# EAGLE design attiny_rc_switch (EAGLE 9.7.0)
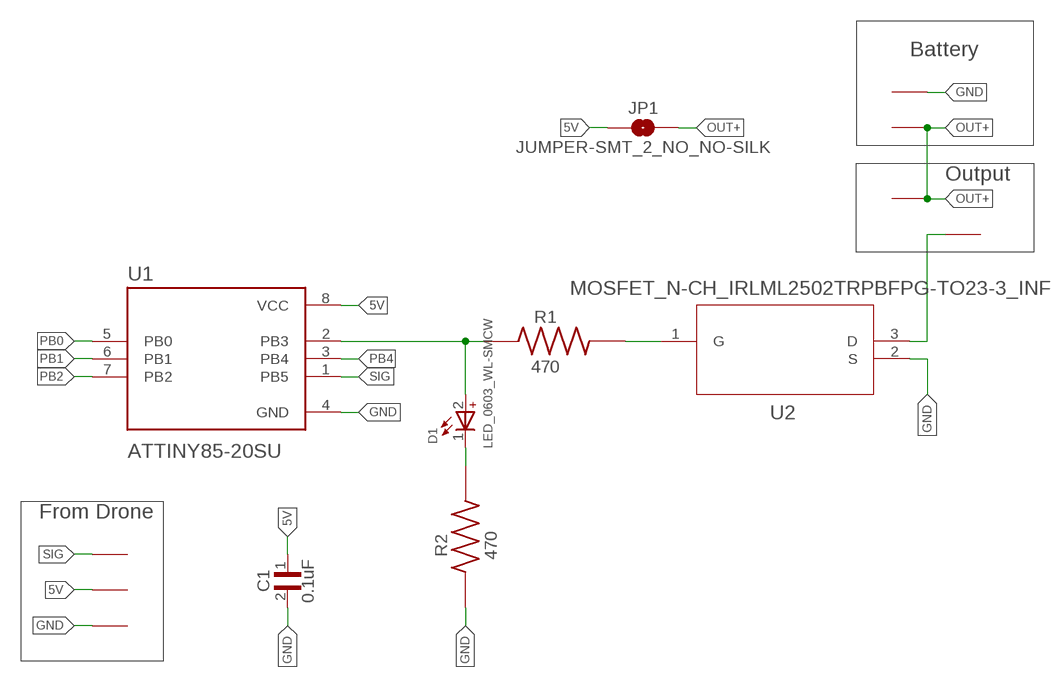
[diagram p0: schematic, sheet 1]

## Parts
C1  0.1uF  CAPACITOR_CERAMIC_0603_50V_CC0603ZRY5V9BB  [CC0603ZRY5V9BB]
D1  LED_0603_WL-SMCW  [LED_0603_WL-SMCW]
JP1  JUMPER-SMT_2_NO_NO-SILK  [SMT-JUMPER_2_NO_NO-SILK]
R1  470  RESISTOR_0603_1/4W_RCS0603  [RCS0603]
R2  470  RESISTOR_0603_1/4W_RCS0603  [RCS0603]
U1  ATTINY85-20SU  [ATTINY85-20SU]
U2  MOSFET_N-CH_IRLML2502TRPBFPG-TO23-3_INF  [MOSFET_N-CH_IRLML2502TRPBF]
U$1  SMD_PAD  [SMD_PAD]
U$2  SMD_PAD  [SMD_PAD]
U$3  SMD_PAD  [SMD_PAD]
U$4  SMD_PAD  [SMD_PAD]
U$5  SMD_PAD  [SMD_PAD]
U$6  SMD_PAD  [SMD_PAD]
U$8  SMD_PAD  [SMD_PAD]

## Nets
5V: C1.1 JP1.1 U1.8(VCC) U$1.P$1
GND: C1.2 R2.1 U1.4(GND) U2.2(S) U$2.P$1 U$4.P$1
N$1: D1.2(+) R1.1 U1.2(PB3)
N$2: R1.2 U2.1(G)
N$3: D1.1(-) R2.2
OUT+: JP1.2 U$3.P$1 U$5.P$1
OUT-: U2.3(D) U$6.P$1
PB0: U1.5(PB0)
PB1: U1.6(PB1)
PB2: U1.7(PB2)
PB4: U1.3(PB4)
SIG: U1.1(PB5) U$8.P$1

## Notes on the sheet
- Battery
- Output
- From Drone

## Library data of the parts
C1 = scotts-library:CAPACITOR_CERAMIC_0603_50V_CC0603ZRY5V9BB: Cap Ceramic 0.1uF 50V Y5V -20% to 80% Pad SMD 0603 85?C T/R
D1 = scotts-library:LED_0603_WL-SMCW: WL-SMCW SMT Mono-color Chip LED Waterclea Characteristics Low energy consumption High reliability Low current requirement Fast switching No UV/IR radiation Smallest SMD LED package for exceptional brightness Top view LED Wide viewing angle Better solder ability Heat dissipation Applications Backlight for mobile and portable device keypads Indoor and outdoor message boards Flat backlight for LCDs, switches and symbols Display for industrial control systems and traffic Miniaturized color effects Pedestrian mark Optical indicators Tabular backlight: LCD, telephone key-press, power-switch, display board Indoor displays Signals Identifiers Backlight for automobile DVD LED General lighting Toys <https://www.we-online.com/catalog/media/o14904v209%20Family_WL-SMCW.jpg> Details see: www.we-online.com/catalog/WL-SMCW <www.we-online.com/catalog/WL-SMCW/?utm_source=eagle_model&utm_medium=description_link&utm_campaign=eisos_eagle> Updated by Ella Wu, 2022-06-16 2022(C) Wurth Elektronik
JP1 = SparkFun-Jumpers:JUMPER-SMT_2_NO: Normally open jumper This jumper has two pads in close proximity to each other. Apply solder to close the connection. Round pads are easier to solder for beginners, but are a lot larger. SparkFun Product that uses the round pads: SparkFun EL Sequencer <https://www.sparkfun.com/products/12781>
R1 R2 = scotts-library:RESISTOR_0603_1/4W_RCS0603: 10K OHM 5% 200PPM
U1 = scotts-library:ATTINY85-20SU: AVR AVR® ATtiny, Functional Safety (FuSa) Microcontroller IC 8-Bit 20MHz 8KB (4K x 16) FLASH 8-SOIC; AVAILABILITY: Good; DESCRIPTION: IC MCU 8BIT 8KB FLASH 8SOIC; MAXIMUM_PACKAGE_HEIGHT: 2.16 mm; MF: Microchip Technology; MP: ATTINY85V-10SU; PACKAGE: None; PARTREV: 2586Q–AVR–08/2013; PRICE: None; PURCHASE-URL: https://pricing.snapeda.com/search/part/ATTINY85V-10SU/?ref=eda
U2 = scotts-library:MOSFET_N-CH_IRLML2502TRPBF; COPYRIGHT: Copyright (C) 2024 Ultra Librarian. All rights reserved.; MANUFACTURER_PART_NUMBER: IRLML2502TRPBF; MFR_NAME: Infineon
U$1-U$6 U$8 = scotts-library:SMD_PAD

## Board
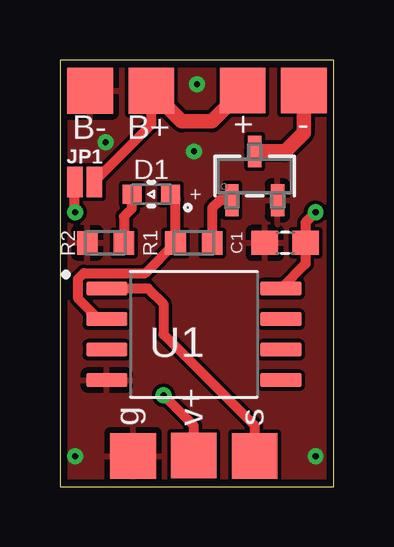
[diagram p1: board, top side]
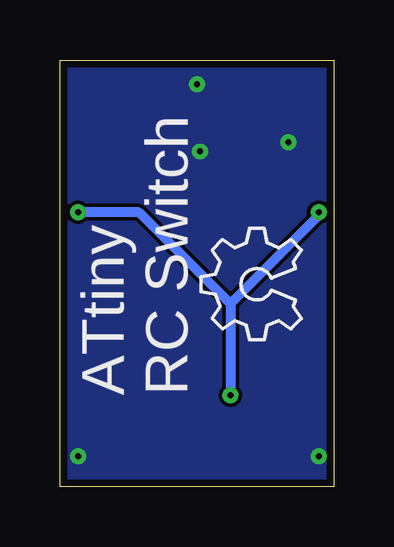
[diagram p2: board, bottom side, seen from below]

Size 11.43 x 17.78 mm. Coordinates in mm from the lower left corner, seen from the top.
Outline: 0,0 11.43,0 11.43,17.78 0,17.78 0,0
Copper layers (1*16): Top 0.035mm / dielectric 1.5mm / Bottom 0.035mm
Design rules "Fusion Electronics Design Rules *": minimum track width 6mil, minimum drill 10mil, track to track 6mil, track to pad 6mil, pad to pad 6mil, via to via 6mil, smd to smd 6mil, copper to edge 12mil, drill to drill 6mil, minimum pad ring 10mil, minimum via ring 8mil, stop-mask expansion 4mil, vias tented up to drill 0mil, thermal gap 10mil

### Footprints (pad centres in the part's own frame; a part is rotated, then mirrored left to right if it is on the bottom)
CC0603ZRY5V9BB = smd 1.1 x 1: 1 -0.85,0; 2 0.85,0
LED_0603_WL-SMCW = smd 0.8 x 0.8: 1 -0.8,0; 2 0.8,0
SMT-JUMPER_2_NO_NO-SILK = smd 0.635 x 1.27: 1 -0.406,0; 2 0.406,0
RCS0603 = smd 0.86 x 0.98: 1 -0.765,0; 2 0.765,0
ATTINY85-20SU = smd 1.71 x 0.58: 1 -3.63,1.905; 2 -3.63,0.635; 3 -3.63,-0.635; 4 -3.63,-1.905; 5 3.63,-1.905; 6 3.63,-0.635; 7 3.63,0.635; 8 3.63,1.905
MOSFET_N-CH_IRLML2502TRPBF = smd 0.559 x 1.321: 1 -0.953,-1.016; 2 0.953,-1.016; 3 0,1.016
SMD_PAD = smd 1.905 x 1.905: P$1 0,0

### Placement (x,y rotation side)
C1  9.4,10.16 180 top
D1  3.81,12.19 0 top
JP1  1.03,12.7 0 top
R1  5.59,10.16 0 top
R2  1.9,10.16 0 top
U1  5.59,6.35 0 top
U2  8.13,12.95 0 top
U$1  5.59,1.3 270 top
U$2  3.05,1.28 270 top
U$3  3.81,16.5 0 top
U$4  1.26,16.5 0 top
U$5  7.62,16.51 0 top
U$6  10.17,16.51 0 top
U$8  8.13,1.28 270 top

### Tracks (layer width: path | path; a pad name or v marks a point on that pad's centre or on a via)
5V  (via drill 0.25 pad 0.61)
  Top 0.406: U$1.P$1 5.59,2.54 v4.32,3.81 | v10.67,11.43 10.25,11.01 C1.1 10.25,9.29 U1.8 | v0.64,11.43 0.62,11.44 JP1.1
  Bottom 0.406: 4.32,7.62 8.13,11.43 v10.67,11.43 | 4.32,7.62 v4.32,3.81 | 4.32,7.62 0.64,11.3 v0.64,11.43
GND  (via drill 0.25)
  other vias: 5.71,16.76 5.59,13.97 10.67,1.27 0.64,1.27 1.9,14.35
  pour Top: -0.69,0.08 11.86,0.08 11.86,17.7 -0.69,17.7
  pour Bottom: -0.69,0.08 11.86,0.08 11.86,17.7 -0.69,17.7
N$1
  Top 0.406: D1.2 4.82,11.98 R1.1 3.56,8.9 1,8.9 0.75,8.65 0.75,7.86 1.62,6.99 U1.2
N$2
  Top 0.406: U2.1 6.67,11.94 6.35,11.62 R1.2
N$3
  Top 0.406: R2.2 2.67,11.26 3.01,11.6 D1.1
OUT+
  Top 0.406: JP1.2 3.81,15.07 U$3.P$1
  Top 0.61: U$5.P$1 6.34,15.23 5.08,15.23 U$3.P$1
OUT-
  Top 0.61: U$6.P$1 10.17,14.74 9.4,13.97 U2.3
SIG
  Top 0.406: U1.1 3.68,8.26 4.32,7.62 4.32,6.35 8.13,2.54 U$8.P$1

### Text on the board
tPlace: + | - | B- | B+ | g | v+ | s
bPlace: ATtiny / RC Switch